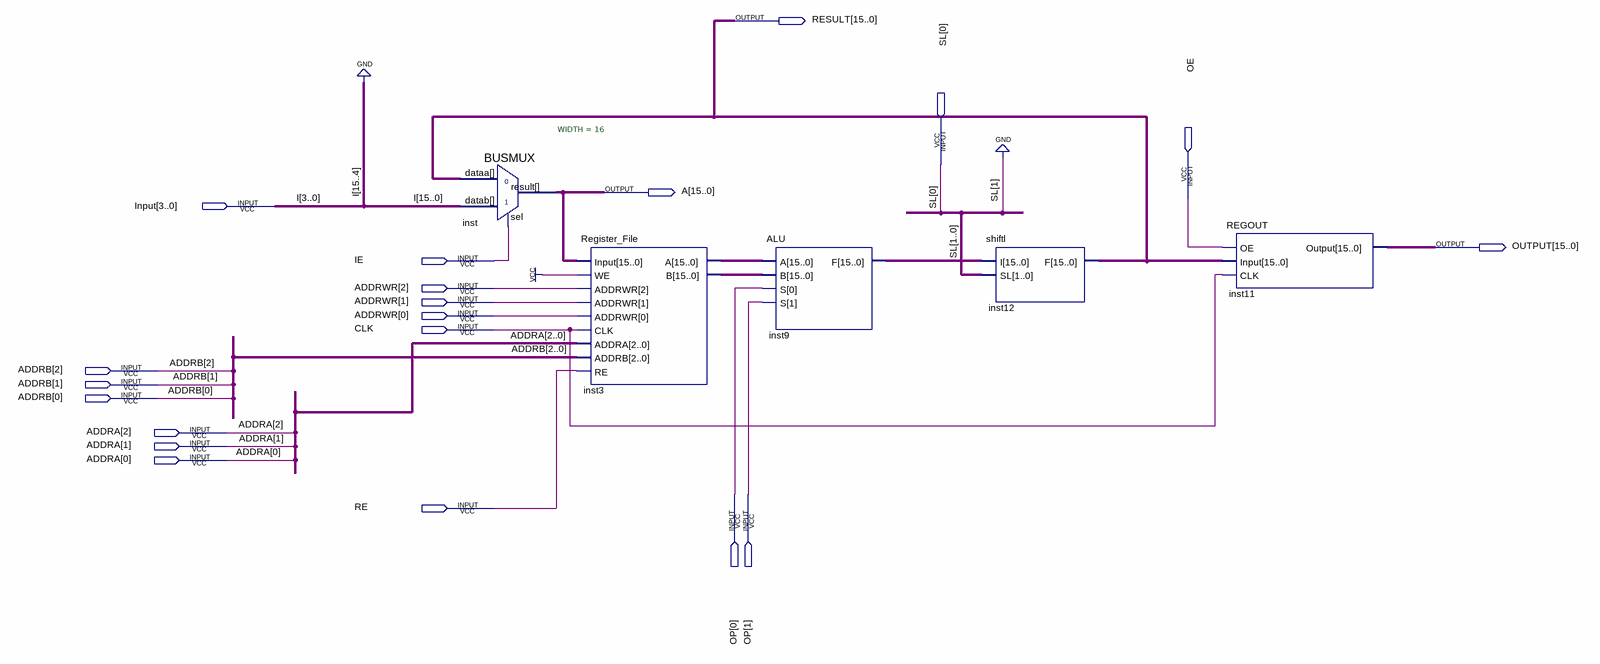
[diagram p0: schematic sheet]
// Quartus schematic Datapath.bdf as structural Verilog: 5 symbols, 20 pins
module Datapath (
  input  [0:0] SL,
  input  OE,
  input  [3:0] Input,
  input  IE,
  input  [2:0] ADDRWR,
  input  CLK,
  input  [2:0] ADDRB,
  input  [2:0] ADDRA,
  input  [1:0] OP,
  input  RE,
  output [15:0] RESULT,
  output [15:0] A,
  output [15:0] OUTPUT
);

  wire [15:0] inst3_a, inst3_b, inst9_f;

  BUSMUX #(.WIDTH(16)) inst (.dataa(RESULT), .datab({{12{1'b0}}, Input}), .sel(IE), .result(A));
  Register_File inst3 (
    .Input(A), .WE(1'b1), .ADDRWR(ADDRWR), .CLK(CLK), .ADDRA(ADDRA), .ADDRB(ADDRB), .RE(RE), .A(inst3_a),
    .B(inst3_b));
  ALU inst9 (.A(inst3_a), .B(inst3_b), .S(OP), .F(inst9_f));
  shiftl inst12 (.I(inst9_f), .SL({1'b0, SL[0]}), .F(RESULT));
  REGOUT inst11 (.OE(OE), .Input(RESULT), .CLK(CLK), .Output(OUTPUT));

  // Other names for the same wires on the sheet: I[3:0] = Input
endmodule
